# EAGLE design Application - out8 16A - bistable relay - 4TE - BOT (EAGLE 6.3)
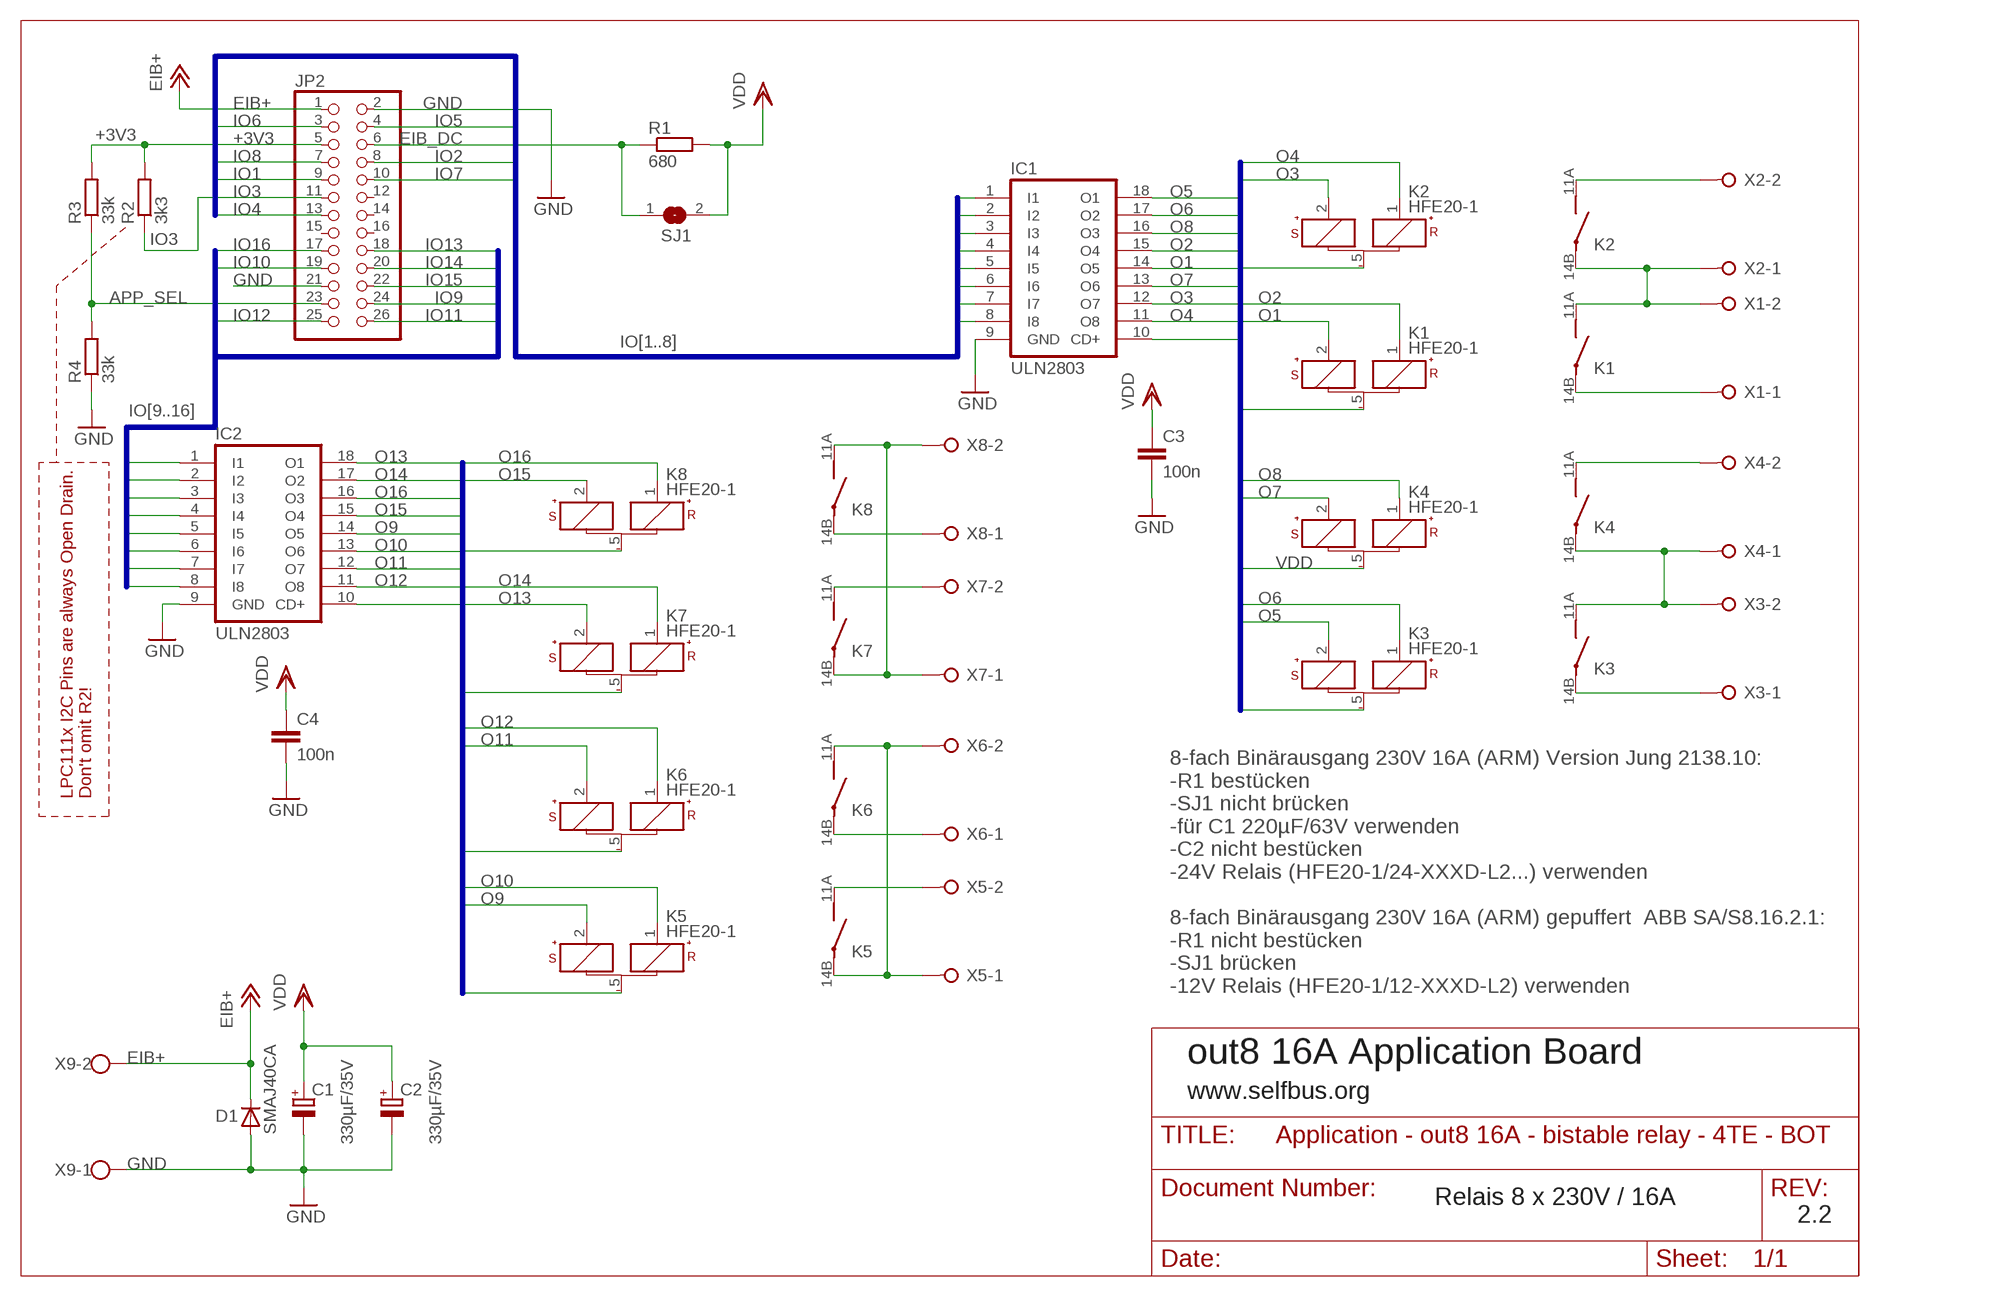
[diagram p0: schematic, sheet 1]

## Parts
C1  330µF/35V  CPOL-EUE3.5-8  [E3,5-8]
C2  330µF/35V  CPOL-EUE3.5-8  [E3,5-8]
C3  100n  C-EUC1206  [C1206]
C4  100n  C-EUC1206  [C1206]
D1  SMAJ40CA  D-SMB  [SMB]
IC1  ULN2803  ULN2803ASOP18  [SO18W]
IC2  ULN2803  ULN2803ASOP18  [SO18W]
JP2  A  PINHD-2X13_2.54-SMD  [2X13SMD]
K1  HFE20-1  HFE20-1-024-1HD504  [HFE20-3-504]
K2  HFE20-1  HFE20-1-024-1HD504  [HFE20-3-504]
K3  HFE20-1  HFE20-1-024-1HD504  [HFE20-3-504]
K4  HFE20-1  HFE20-1-024-1HD504  [HFE20-3-504]
K5  HFE20-1  HFE20-1-024-1HD504  [HFE20-3-504]
K6  HFE20-1  HFE20-1-024-1HD504  [HFE20-3-504]
K7  HFE20-1  HFE20-1-024-1HD504  [HFE20-3-504]
K8  HFE20-1  HFE20-1-024-1HD504  [HFE20-3-504]
R1  680  R-EU_M1206  [M1206]
R2  3k3  R-EU_M1206  [M1206]
R3  33k  R-EU_M1206  [M1206]
R4  33k  R-EU_M1206  [M1206]
SJ1  A  SJ  [SJ]
X1  W237-02P  [W237-132]
X2  W237-02P  [W237-132]
X3  W237-02P  [W237-132]
X4  W237-02P  [W237-132]
X5  W237-02P  [W237-132]
X6  W237-02P  [W237-132]
X7  W237-02P  [W237-132]
X8  W237-02P  [W237-132]
X9  W237-102  [W237-102]

## Nets
+3V3: JP2.5 R2.2 R3.2
APP_SEL: JP2.23 R3.1 R4.2
EIB+: D1.1(C) JP2.1 X9.2
EIB_DC: JP2.6 R1.1 SJ1.1
GND: C1.- C2.- C3.2 C4.2 D1.2(A) IC1.9(GND) IC2.9(GND) JP2.2 JP2.21 R4.1 X9.1
IO1: IC1.5(I5) JP2.9
IO2: IC1.4(I4) JP2.8
IO3: IC1.7(I7) JP2.11 R2.1
IO4: IC1.8(I8) JP2.13
IO5: IC1.1(I1) JP2.4
IO6: IC1.2(I2) JP2.3
IO7: IC1.6(I6) JP2.10
IO8: IC1.3(I3) JP2.7
IO9: IC2.5(I5) JP2.24
IO10: IC2.6(I6) JP2.19
IO11: IC2.7(I7) JP2.26
IO12: IC2.8(I8) JP2.25
IO13: IC2.1(I1) JP2.18
IO14: IC2.2(I2) JP2.20
IO15: IC2.4(I4) JP2.22
IO16: IC2.3(I3) JP2.17
K12: K1.11A(PB) K2.14B(PA) X1.2 X2.1
K34: K3.11A(PB) K4.14B(PA) X3.2 X4.1
K56: K5.14B(PA) K6.11A(PB) X5.1 X6.2
K78: K7.14B(PA) K8.11A(PB) X7.1 X8.2
N$1: K4.11A(PB) X4.2
N$2: K8.14B(PA) X8.1
N$3: K1.14B(PA) X1.1
N$4: K3.14B(PA) X3.1
N$8: K2.11A(PB) X2.2
N$11: K7.11A(PB) X7.2
N$13: K5.11A(PB) X5.2
N$14: K6.14B(PA) X6.1
O1: IC1.14(O5) K1.2(S+)
O2: IC1.15(O4) K1.1(R+)
O3: IC1.12(O7) K2.2(S+)
O4: IC1.11(O8) K2.1(R+)
O5: IC1.18(O1) K3.2(S+)
O6: IC1.17(O2) K3.1(R+)
O7: IC1.13(O6) K4.2(S+)
O8: IC1.16(O3) K4.1(R+)
O9: IC2.14(O5) K5.2(S+)
O10: IC2.13(O6) K5.1(R+)
O11: IC2.12(O7) K6.2(S+)
O12: IC2.11(O8) K6.1(R+)
O13: IC2.18(O1) K7.2(S+)
O14: IC2.17(O2) K7.1(R+)
O15: IC2.15(O4) K8.2(S+)
O16: IC2.16(O3) K8.1(R+)
VDD: C1.+ C2.+ C3.1 C4.1 IC1.10(CD+) IC2.10(CD+) K1.5(-) K2.5(-) K3.5(-) K4.5(-) K5.5(-) K6.5(-) K7.5(-) K8.5(-) R1.2 SJ1.2
Unconnected: JP2.12 JP2.14 JP2.15 JP2.16

## Buses
IO[1..8]
IO[9..16]
O[9..16],VDD
O[1..8],VDD

## Notes on the sheet
- LPC111x I2C Pins are always Open Drain.
  Don't omit R2!
- 8-fach Binärausgang 230V 16A (ARM) Version Jung 2138.10:
  -R1 bestücken
  -SJ1 nicht brücken
  -für C1 220µF/63V verwenden
  -C2 nicht bestücken
  -24V Relais (HFE20-1/24-XXXD-L2...) verwenden
  
  8-fach Binärausgang 230V 16A (ARM) gepuffert  ABB SA/S8.16.2.1:
  -R1 nicht bestücken
  -SJ1 brücken
  -12V Relais (HFE20-1/12-XXXD-L2) verwenden
- out8 16A Application Board
- www.selfbus.org
- Relais 8 x 230V / 16A
- 2.2

## Library data of the parts
C1 C2 = rcl:CPOL-EU: POLARIZED CAPACITOR, European symbol
C3 C4 = rcl:C-EU: CAPACITOR, European symbol
D1 = semicon-smd-ipc:D-: DIODE unfilled
IC1 IC2 = uln-udn:ULN2803A: DRIVER ARRAY
JP2 = pinhead:PINHD-2X13: PIN HEADER
K1-K8 = sb-relay:HFE20-1-024-1HD
R1-R4 = rcl:R-EU_: RESISTOR, European symbol
SJ1 = jumper:SJ: SMD solder JUMPER
X1-X8 = con-wago-508:W237-02P: WAGO SREW CLAMP; OC_FARNELL: unknown; OC_NEWARK: unknown
X9 = con-wago-500:W237-102: WAGO SCREW CLAMP

## Net classes
1 230Vac: width 1.93 mm, clearance 5.08 mm to class 0, clearance 1.905 mm

## Board
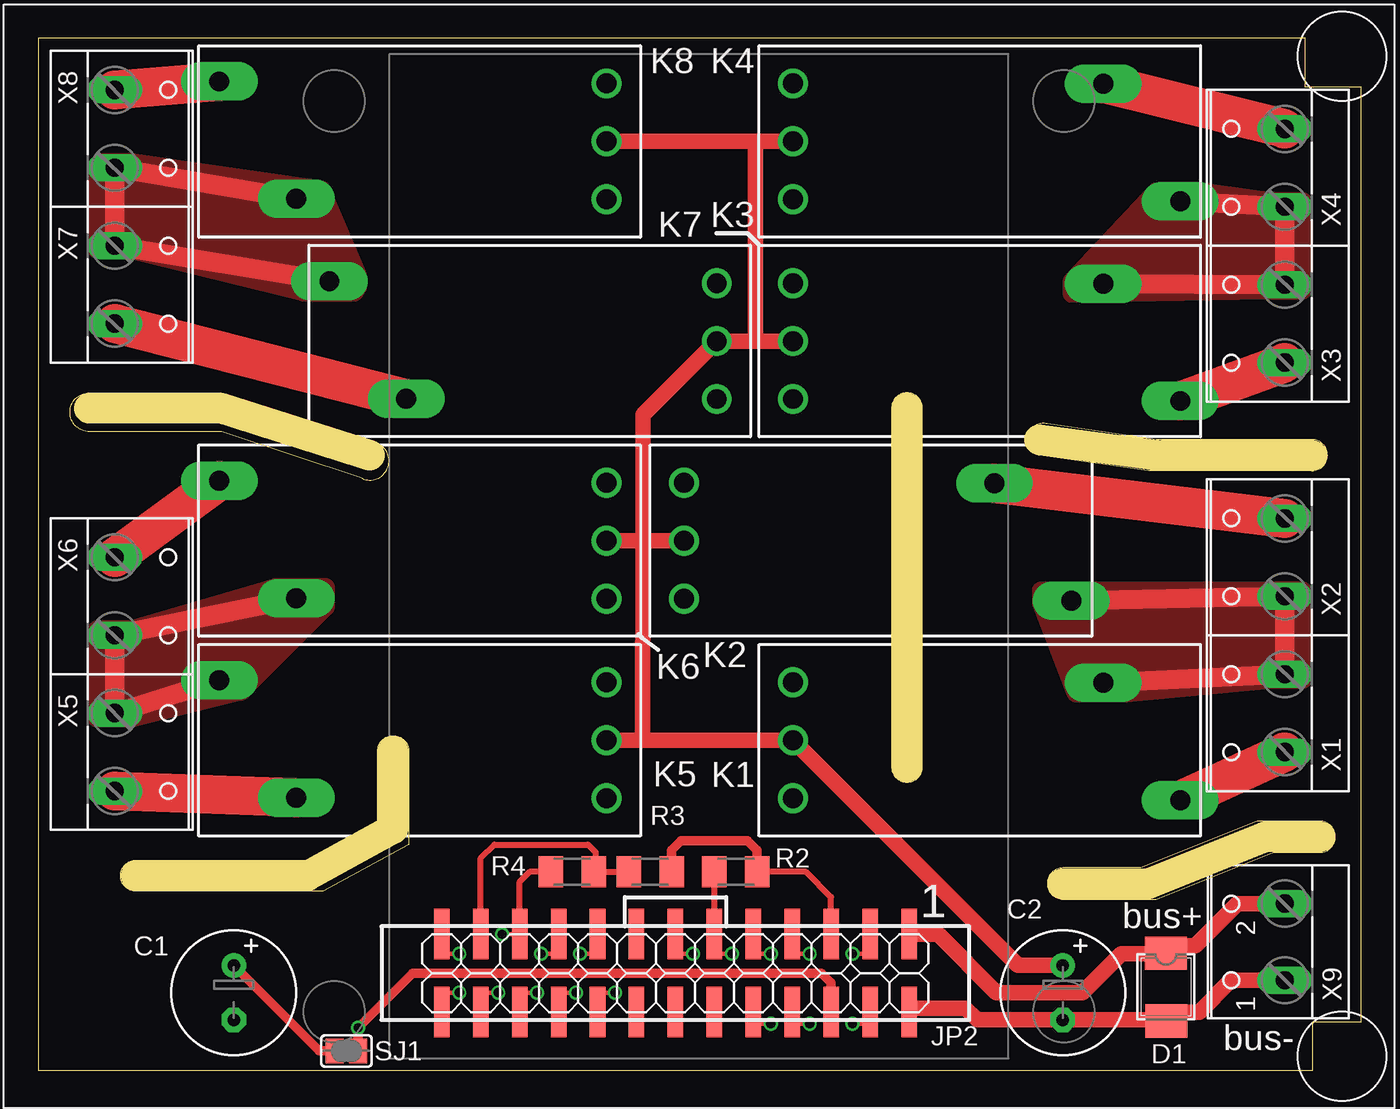
[diagram p1: board, top side]
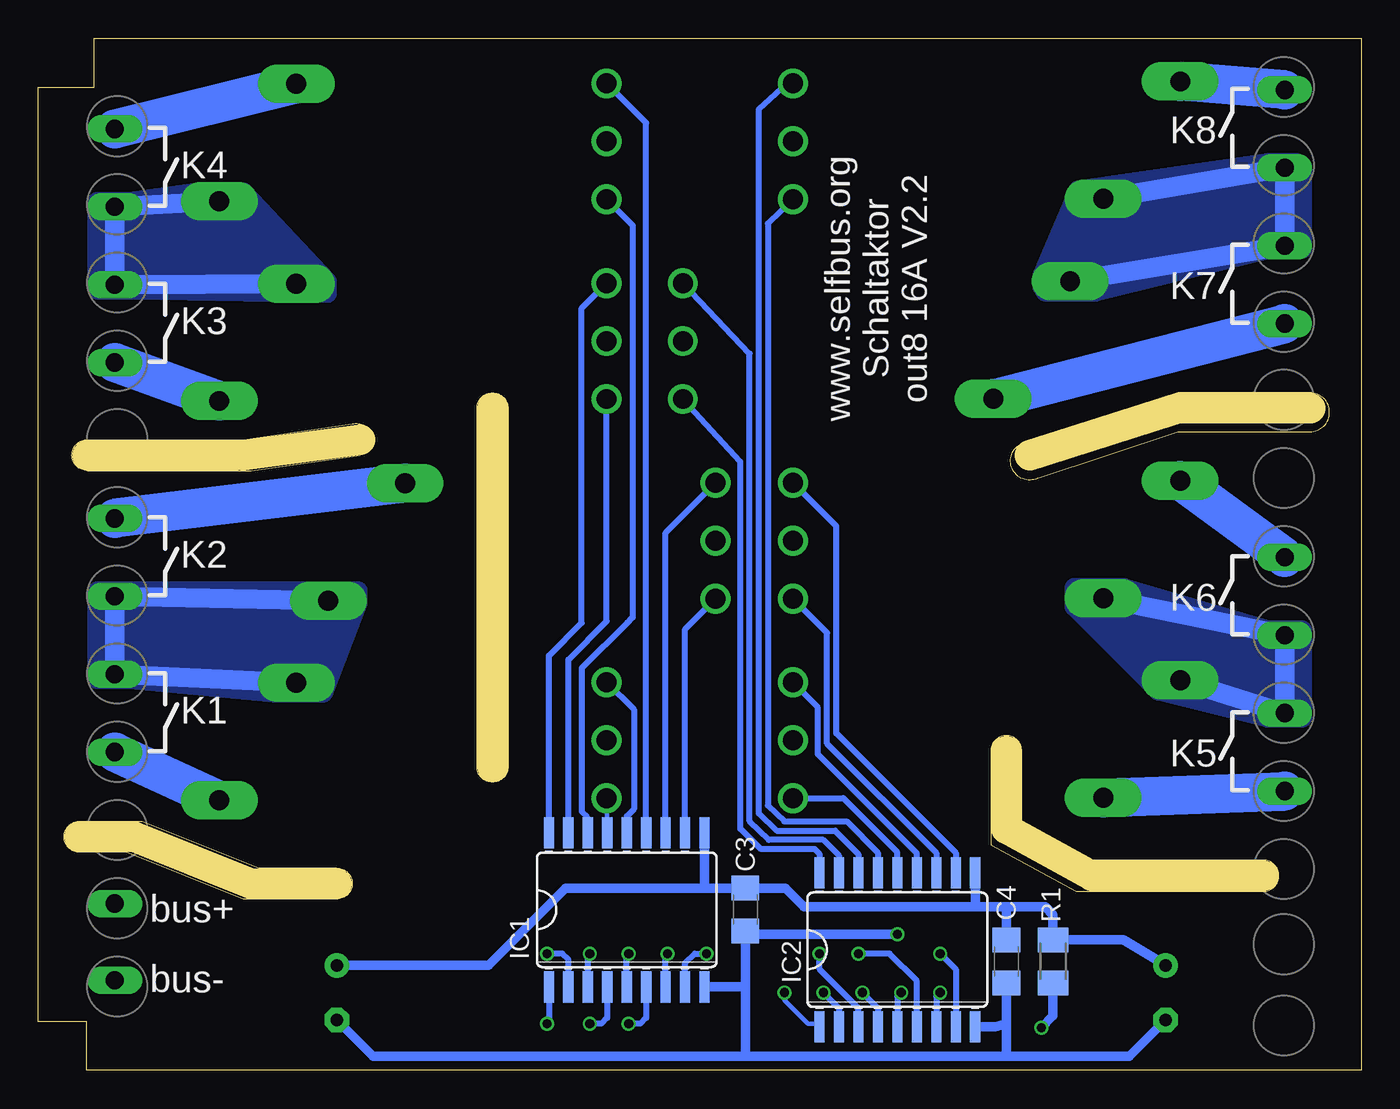
[diagram p2: board, bottom side, seen from below]

Size 86.3 x 67.31 mm. Coordinates in mm from the lower left corner, seen from the top.
Outline: 3.34,44.2 11.97,44.2 22.13,40.89 arc-180 21.12,38.61 11.97,41.66 3.34,41.66 arc-180 3.34,44.2
Outline: 6.38,13.72 17.56,13.72 22.13,16.26 22.13,20.83 arc-180 24.16,20.83 24.16,14.73 18.58,11.68 6.38,11.68 arc-180 6.38,13.72
Outline: 55.66,43.18 55.66,19.81 arc180 57.69,19.81 57.69,43.18 arc180 55.66,43.18
Outline: 83.6,16.26 79.54,16.26 71.92,13.21 66.84,13.21 arc180 66.84,11.18 72.93,11.18 80.55,14.22 83.6,14.22 arc180 83.6,16.26
Outline: 83.09,39.12 72.42,39.12 65.31,40.13 arc-180 65.82,42.16 72.93,41.15 83.09,41.15 arc-180 83.09,39.12
Copper layers (1*16): Top 0.035mm / dielectric 1.5mm / Bottom 0.035mm
Design rules "SeeedStudio_2layer_DRU_no_angle_20140221": minimum track width 6mil, minimum drill 12mil, track to track 6mil, track to pad 6mil, pad to pad 6mil, via to via 6mil, smd to smd 0mil, copper to edge 10mil, drill to drill 10mil, minimum pad ring 10mil, minimum via ring 6mil, stop-mask expansion 2mil, vias tented up to drill 100mil, thermal gap 10mil
Milling: 11 lines

### Footprints (pad centres in the part's own frame; a part is rotated, then mirrored left to right if it is on the bottom)
E3,5-8 = drill 0.813 pad 1.6: + -1.778,0 | drill 0.813 pad 1.6 octagon: - 1.778,0
C1206 = smd 1.6 x 1.8: 1 -1.4,0; 2 1.4,0
SMB = smd 2.159 x 2.743: 1 -2.311,-0.127; 2 2.108,-0.102
SO18W = smd 0.66 x 2.032: 1 -5.08,-5.029; 2 -3.81,-5.029; 3 -2.54,-5.029; 4 -1.27,-5.029; 5 0,-5.029; 6 1.27,-5.029; 7 2.54,-5.029; 8 3.81,-5.029; 9 5.08,-5.029; 10 5.08,5.029; 11 3.81,5.029; 12 2.54,5.029; 13 1.27,5.029; 14 0,5.029; 15 -1.27,5.029; 16 -2.54,5.029; 17 -3.81,5.029; 18 -5.08,5.029
2X13SMD = smd 1.016 x 3.302: 1 -1.27,-3.81; 2 -1.27,1.27; 3 1.27,-3.81; 4 1.27,1.27; 5 3.81,-3.81; 6 3.81,1.27; 7 6.35,-3.81; 8 6.35,1.27; 9 8.89,-3.81; 10 8.89,1.27; 11 11.43,-3.81; 12 11.43,1.27; 13 13.97,-3.81; 14 13.97,1.27; 15 16.51,-3.81; 16 16.51,1.27; 17 19.05,-3.81; 18 19.05,1.27; 19 21.59,-3.81; 20 21.59,1.27; 21 24.13,-3.81; 22 24.13,1.27; 23 26.67,-3.81; 24 26.67,1.27; 25 29.21,-3.81; 26 29.21,1.27
HFE20-3-504 = drill 1.3: 1 -12.6,-3.78; 2 -12.6,3.78; 5 -12.6,0 | drill 1.3 pad 2.5 long: 11A 7.65,3.75; 14B 12.67,-3.91
M1206 = smd 1.6 x 2: 1 -1.4,0; 2 1.4,0
SJ = smd 1.168 x 1.6: 1 -0.762,0; 2 0.762,0
W237-132 = drill 1.194 long: 1 -2.54,-0.635; 2 2.54,-0.635
W237-102 = drill 1.194 long: 1 -2.5,-1.27; 2 2.5,-1.27

### Placement (x,y rotation side)
C1  12.75,5.08 270 top
C2  66.84,5.08 270 top
C3  40.17,10.48 270 bottom
C4  23.15,7.11 270 bottom
D1  73.69,5.33 270 top
IC1  47.91,10.48 0 bottom
IC2  30.26,7.87 0 bottom
JP2  55.53,5.08 180 top
K1  61.82,21.53 0 top
K2  54.72,34.55 0 top
K3  61.82,47.57 0 top
K4  61.82,60.59 0 top
K5  24.48,21.53 180 top
K6  24.48,34.55 180 top
K7  31.66,47.57 180 top
K8  24.48,60.59 180 top
R1  20.1,7.11 90 bottom
R2  45.5,12.95 0 top
R3  39.91,12.95 0 top
R4  34.83,12.95 0 top
SJ1  20.1,1.27 180 top
U$1  [HUT4C-NO-DRILL]  -2.25,69.53 270 top
X1  80.68,23.3 90 top
X2  80.68,33.46 90 top
X3  80.68,48.7 90 top
X4  80.68,58.86 90 top
X5  5.62,20.76 270 top
X6  5.62,30.92 270 top
X7  5.62,51.24 270 top
X8  5.62,61.4 270 top
X9  80.04,8.38 90 top

### Tracks (layer width: path | path; a pad name or v marks a point on that pad's centre or on a via)
+3V3
  Top 0.406: JP2.5 51.72,11.3 50.07,12.95 R2.2
  Top 0.61: R3.2 41.31,14.35 41.94,14.99 46.26,14.99 46.9,14.35 R2.2
APP_SEL
  Top 0.406: JP2.23 28.86,13.84 29.75,14.73 35.85,14.73 36.36,14.22 36.36,13.08 R4.2 R3.1
EIB+
  Top 1.016: X9.2 78.23,10.88 75.47,8.13 74.05,8.13 D1.1 73.54,7.62 70.65,7.62 68.11,5.08 62.52,5.08 58.71,8.89 JP2.1
EIB_DC  (via drill 0.6)
  Top 0.61: JP2.6 51.72,5.71 51.09,6.35 24.42,6.35 v20.86,2.79 SJ1.1
  Top 0.813: JP2.6 51.72,3.17
  Bottom 0.61: R1.1 20.1,3.56 v20.86,2.79
GND  (via drill 0.6)
  Top 0.305: JP2.21 v30.26,8.89
  Top 0.406: JP2.21 31.4,12.32 32.04,12.95 R4.1
  Top 1.016: JP2.2 57.06,4.06 60.49,4.06 61.25,3.3 C2.- 73.52,3.3 D1.2 74.18,3.81 75.73,3.81 77.8,5.88 X9.1
  Bottom 0.61: 23.15,0.92 39.4,0.92 | 39.4,0.92 64.46,0.92 C2.- | v30.26,8.89 39.47,8.89 C3.2 40.17,5.59 | C4.2 23.15,3.05 | 23.15,3.05 23.15,0.92 | IC2.9 23.86,2.84 23.15,3.05 | 40.17,5.59 40.17,0.93 39.4,0.92 | IC1.9 40.31,5.45 40.17,5.59 | 23.15,0.92 15.12,0.92 C1.-
IO1  (via drill 0.6)
  Top 0.305: JP2.9 46.64,7.62 v47.79,7.62
  Bottom 0.406: IC1.5 47.91,7.49 v47.79,7.62
IO2  (via drill 0.6)
  Top 0.305: JP2.8 49.18,3.05 v50.33,3.05
  Bottom 0.406: IC1.4 49.18,3.43 49.56,3.05 v50.33,3.05
IO3  (via drill 0.6)
  Top 0.305: JP2.11 44.1,7.62 v45.25,7.62
  Top 0.406: JP2.11 R2.1
  Bottom 0.406: IC1.7 45.37,7.49 v45.25,7.62
IO4  (via drill 0.6)
  Top 0.305: JP2.13 41.56,7.62 v42.71,7.62
  Bottom 0.406: IC1.8 44.1,6.98 43.47,7.62 v42.71,7.62
IO5  (via drill 0.6)
  Top 0.305: JP2.4 54.26,3.05 v53.12,3.05
  Bottom 0.406: IC1.1 52.99,3.17 v53.12,3.05
IO6  (via drill 0.6)
  Top 0.305: JP2.3 54.26,7.62 v53.12,7.62
  Bottom 0.406: IC1.2 51.72,7.24 52.1,7.62 v53.12,7.62
IO7  (via drill 0.6)
  Top 0.305: JP2.10 46.64,3.05 v47.79,3.05
  Bottom 0.406: IC1.6 46.64,3.43 47.02,3.05 v47.79,3.05
IO8  (via drill 0.6)
  Top 0.305: JP2.7 49.18,7.62 v50.33,7.62
  Bottom 0.406: IC1.3 50.45,7.49 v50.33,7.62
IO9  (via drill 0.6)
  Top 0.305: JP2.24 28.86,5.08 v30.01,5.08
  Bottom 0.406: v30.01,5.08 30.26,4.83 IC2.5
IO10  (via drill 0.6)
  Top 0.305: v32.8,7.62 33.82,7.62 33.82,8.76 JP2.19
  Bottom 0.406: IC2.6 28.99,5.84 30.77,7.62 v32.8,7.62
IO11  (via drill 0.6)
  Top 0.305: JP2.26 26.32,5.08 v27.47,5.08
  Bottom 0.406: v27.47,5.08 27.72,4.83 IC2.7
IO12  (via drill 0.6)
  Top 0.305: JP2.25 26.32,7.62 v27.47,7.62
  Bottom 0.406: v27.47,7.62 26.45,6.6 IC2.8
IO13  (via drill 0.6)
  Top 0.305: JP2.18 36.36,3.94 36.36,5.08 v37.63,5.08
  Bottom 0.305: v37.63,5.08 37.63,4.57 36.1,3.05 35.54,3.05 IC2.1
IO14  (via drill 0.6)
  Top 0.305: JP2.20 33.94,5.08 v35.09,5.08
  Bottom 0.406: v35.09,5.08 34.07,4.06 IC2.2
IO15  (via drill 0.6)
  Top 0.305: JP2.22 31.4,5.08 v32.55,5.08
  Bottom 0.406: v32.55,5.08 31.53,4.06 IC2.4
IO16  (via drill 0.6)
  Top 0.305: v35.34,7.62 36.36,7.62 36.48,7.75 JP2.17
  Bottom 0.406: IC2.3 32.8,4.06 35.34,6.6 v35.34,7.62
K12
  Top 1.27: K2.14B X2.1 X1.2 K1.11A
  Bottom 1.27: K2.14B X2.1 X1.2 K1.11A
  pour Top (no thermals): 82.46,31.24 80.3,31.24 68.87,31.24 65.57,31.24 65.44,31.24 65.44,30.61 67.72,24.64 70.9,24.64 80.3,25.53 82.46,25.53
  pour Bottom (no thermals): 82.46,31.24 65.44,31.24 65.44,30.61 67.72,24.64 70.9,24.64 80.3,25.53 82.46,25.53
K34
  Top 1.27: K4.14B X4.1 X3.2 K3.11A
  Bottom 1.27: K3.11A X3.2 X4.1 K4.14B
  pour Bottom (no thermals): 80.3,56.64 75.85,57.28 72.93,57.28 67.47,51.43 67.47,50.67 80.17,50.93 82.46,50.93 82.46,56.64
  pour Top (no thermals): 80.3,56.64 75.85,57.28 72.93,57.28 67.47,51.43 67.47,50.67 80.17,50.93 82.46,50.93 82.46,56.64
K56
  Top 1.27: K6.11A X6.2 X5.1 K5.14B
  Bottom 1.27: K6.11A X6.2 X5.1 K5.14B
  pour Top (no thermals): 4.1,28.7 6,28.7 15.53,31.5 18.7,31.5 18.7,30.23 13.24,24.76 6.13,22.99 3.84,22.99 3.84,28.7
  pour Bottom (no thermals): 3.84,28.7 6,28.7 15.53,31.5 18.7,31.5 18.7,30.23 13.24,24.76 6.13,22.99 3.84,22.99
K78
  Top 1.27: K8.11A X8.2 X7.1 K7.14B
  Bottom 1.27: K8.11A X8.2 X7.1 K7.14B
  pour Bottom (no thermals): 4.22,59.05 4.22,59.18 6,59.18 18.45,57.4 20.99,51.43 20.61,50.8 17.31,50.8 5.88,53.59 3.84,53.59 3.84,58.93
  pour Top (no thermals): 4.22,59.05 4.22,59.18 6,59.18 18.45,57.4 20.99,51.43 20.61,50.8 17.31,50.8 5.88,53.59 3.84,53.59 3.84,58.93
N$1
  Top 2.54: X4.2 K4.11A
  Bottom 2.54: X4.2 K4.11A
N$2
  Top 2.54: X8.1 K8.14B
  Bottom 2.54: X8.1 K8.14B
N$3
  Top 2.54: K1.14B X1.1
  Bottom 2.54: K1.14B X1.1
N$4
  Top 2.54: K3.14B X3.1
  Bottom 2.54: K3.14B X3.1
N$8
  Top 2.54: K2.11A X2.2
  Bottom 2.54: K2.11A X2.2
N$11
  Top 2.54: K7.11A X7.2
  Bottom 2.54: K7.11A X7.2
N$13
  Top 2.54: K5.11A X5.2
  Bottom 2.54: K5.11A X5.2
N$14
  Top 2.54: K6.14B X6.1
  Bottom 2.54: K6.14B X6.1
O1
  Bottom 0.406: K1.2 47.45,23.54 47.45,17.05 47.91,16.59 IC1.14
O2
  Bottom 0.305: IC1.15 49.18,17.72 K1.1
O3
  Bottom 0.406: IC1.12 45.37,35.08 K2.2
O4
  Bottom 0.406: IC1.11 44.1,28.79 K2.1
O5
  Bottom 0.406: IC1.18 52.99,27.05 50.85,29.2 50.85,49.72 K3.2
O6
  Bottom 0.406: IC1.17 51.72,26.8 49.22,29.3 K3.1
O7
  Bottom 0.406: IC1.13 46.64,61.79 K4.2
O8
  Bottom 0.305: IC1.16 50.45,15.62
  Bottom 0.406: K4.1 47.53,55.12 47.53,29.55 47.62,29.46 47.87,29.21 50.85,26.23 50.85,16.88 50.5,16.54 50.5,15.56 IC1.16
O9
  Bottom 0.406: K5.2 33.79,17.75 30.26,14.22 IC2.14
O10
  Bottom 0.406: IC2.13 29.01,12.92 29.01,14.19 35.45,20.63 35.45,23.68 K5.1
O11
  Bottom 0.406: IC2.12 27.72,14.19 34.85,21.32 34.85,28.54 K6.2
O12
  Bottom 0.406: IC2.11 26.45,14.18 34.25,21.98 34.25,35.5 K6.1
O13
  Bottom 0.406: K7.2 40.5,39.7 40.5,15.75 39.15,14.44 35.65,14.44 35.34,14.14 IC2.18
O14
  Bottom 0.406: K7.1 39.9,46.75 39.9,16.26 38.64,15.04 35.09,15.04 34.07,14.02 IC2.17
O15
  Bottom 0.406: K8.2 38.7,55.24 38.7,17.27 37.63,16.24 33.56,16.24 31.53,14.21 IC2.15
O16
  Bottom 0.305: K8.1 37.45,64.37
  Bottom 0.406: 37.45,64.37 39.3,62.67 39.3,16.76 38.13,15.64 34.32,15.64 32.8,14.12 IC2.16
VDD
  Top 0.61: SJ1.2 18.34,1.27 C1.+
  Top 1.016: K4.5 46.77,60.59 | 46.77,60.59 K8.5 | K3.5 46.76,47.57 | 46.76,47.57 K7.5 39.45,42.77 39.45,34.55 | K6.5 39.45,34.55 | 39.45,34.55 K2.5 | 39.4,21.53 K1.5 63.9,6.86 C2.+ | 39.4,21.53 K5.5 | 39.45,34.55 39.4,21.53 | 46.76,47.57 46.77,47.58 46.77,60.59
  Bottom 0.61: 25.18,10.67 36.36,10.67 37.57,11.88 C3.1 42.96,11.88 | 25.18,10.67 23.15,10.67 | 23.15,10.67 20.61,10.67 20.1,10.16 R1.2 15.53,8.51 C1.+ | IC2.10 25.18,10.67 | C4.1 23.15,10.67 | IC1.10 42.83,12.01 42.96,11.88 | 42.96,11.88 51.9,11.88 56.93,6.86 C2.+

### Text on the board
tPlace: 1
bPlace: K8 | K4 | K7 | K3 | K2 | K6 | K1 | K5 | bus+ | bus-
tNames: bus+ | bus-
bNames: www.selfbus.org / Schaltaktor / out8 16A V2.2